# EAGLE schematic Wireless (EAGLE 7.3.0)
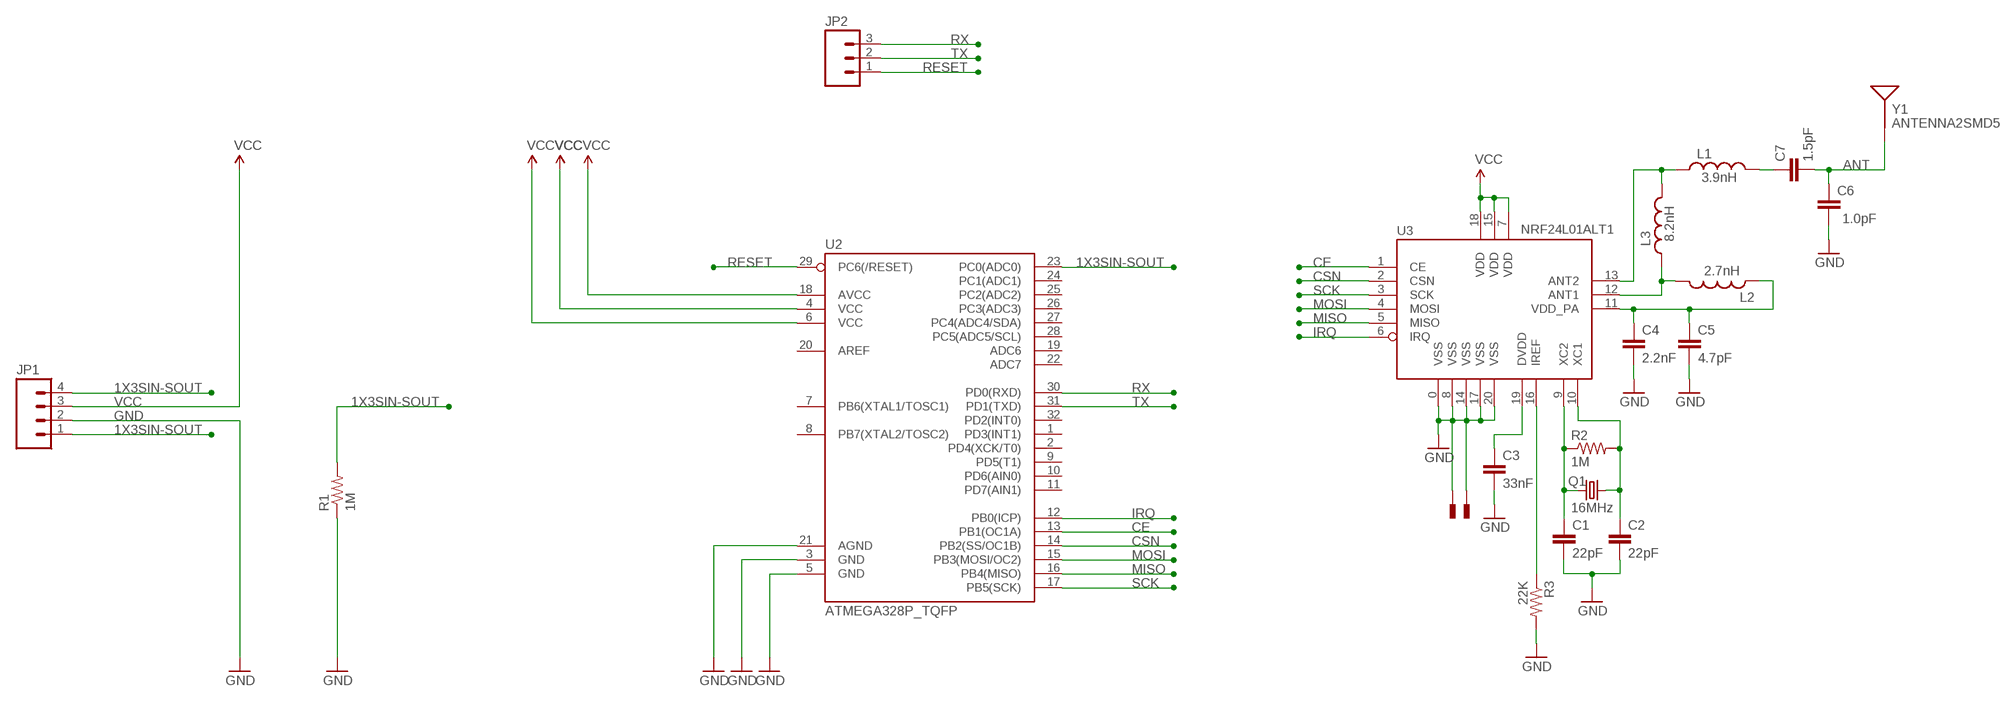
[diagram p0: schematic, sheet 1]

## Parts
C1  22pF  CAP0402-CAP  [0402-CAP]
C2  22pF  CAP0402-CAP  [0402-CAP]
C3  33nF  CAP0402-CAP  [0402-CAP]
C4  2.2nF  CAP0402-CAP  [0402-CAP]
C5  4.7pF  CAP0402-CAP  [0402-CAP]
C6  1.0pF  CAP0402-CAP  [0402-CAP]
C7  1.5pF  CAP0402-CAP  [0402-CAP]
JP1  M04PTH  [1X04]
JP2  M03PTH  [1X03]
L1  3.9nH  INDUCTOR0402  [C0402]
L2  2.7nH  INDUCTOR0402  [C0402]
L3  8.2nH  INDUCTOR0402  [C0402]
Q1  16MHz  CRYSTAL5X3  [CRYSTAL-SMD-5X3]
R1  1M  R-US_R0603  [R0603]
R2  1M  RESISTOR0402-RES  [0402-RES]
R3  22K  RESISTOR0402-RES  [0402-RES]
U2  ATMEGA328P_TQFP  [TQFP32-08]
U3  NRF24L01ALT1  [QFN20_ALT1]
U$1  PAD  [PAD-0.008]
U$4  PAD  [PAD-0.008]
Y1  ANTENNA2SMD5  [ANTENNA-CHIP5]

## Nets
1X3SIN-SOUT: JP1.1 JP1.4 R1.2 U2.23(PC0(ADC0))
ANT: C6.2 C7.2 Y1.FEED(SIGNAL)
CE: U2.13(PB1(OC1A)) U3.1(CE)
CSN: U2.14(PB2(SS/OC1B)) U3.2(CSN)
GND: C1.2 C2.2 C3.2 C4.2 C5.2 C6.1 JP1.2 R1.1 R3.2 U2.3(GND) U2.5(GND) U2.21(AGND) U3.0(VSS) U3.8(VSS) U3.14(VSS) U3.17(VSS) U3.20(VSS) U$1.P$1 U$4.P$1
IRQ: U2.12(PB0(ICP)) U3.6(IRQ)
MISO: U2.16(PB4(MISO)) U3.5(MISO)
MOSI: U2.15(PB3(MOSI/OC2)) U3.4(MOSI)
N$1: C1.1 Q1.1 R2.1 U3.9(XC2)
N$2: C2.1 Q1.3 R2.2 U3.10(XC1)
N$3: L2.2 L3.1 U3.12(ANT1)
N$4: R3.1 U3.16(IREF)
N$5: C3.1 U3.19(DVDD)
N$6: L1.1 L3.2 U3.13(ANT2)
N$7: C4.1 C5.1 L2.1 U3.11(VDD_PA)
N$9: C7.1 L1.2
RESET: JP2.1 U2.29(PC6(/RESET))
RX: JP2.3 U2.30(PD0(RXD))
SCK: U2.17(PB5(SCK)) U3.3(SCK)
TX: JP2.2 U2.31(PD1(TXD))
VCC: JP1.3 U2.4(VCC) U2.6(VCC) U2.18(AVCC) U3.7(VDD) U3.15(VDD) U3.18(VDD)
Unconnected: U2.1(PD3(INT1)) U2.2(PD4(XCK/T0)) U2.7(PB6(XTAL1/TOSC1)) U2.8(PB7(XTAL2/TOSC2)) U2.9(PD5(T1)) U2.10(PD6(AIN0)) U2.11(PD7(AIN1)) U2.19(ADC6) U2.20(AREF) U2.22(ADC7) U2.24(PC1(ADC1)) U2.25(PC2(ADC2)) U2.26(PC3(ADC3)) U2.27(PC4(ADC4/SDA)) U2.28(PC5(ADC5/SCL)) U2.32(PD2(INT0))

## Library data of the parts
C1-C7 = SparkFun:CAP: Capacitor Standard 0603 ceramic capacitor, and 0.1" leaded capacitor.
JP1 = SparkFun-Connectors:M04: Header 4 Standard 4-pin 0.1" header. Use with straight break away headers (SKU : PRT-00116), right angle break away headers (PRT-00553), swiss pins (PRT-00743), machine pins (PRT-00117), and female headers (PRT-00115). Molex polarized connector foot print use with SKU : PRT-08231 with associated crimp pins and housings. 1MM SMD Version SKU: PRT-10208
JP2 = SparkFun-Connectors:M03: Header 3 Standard 3-pin 0.1" header. Use with straight break away headers (SKU : PRT-00116), right angle break away headers (PRT-00553), swiss pins (PRT-00743), machine pins (PRT-00117), and female headers (PRT-00115). Molex polarized connector foot print use with SKU : PRT-08232 with associated crimp pins and housings.
L1-L3 = SparkFun:INDUCTOR: Inductors Basic Inductor/Choke - 0603 and 1206. Footprints are not proven and vary greatly between part numbers.
Q1 = SparkFun:CRYSTAL: Crystals Various standard crystals. Proven footprints. Spark Fun Electronics SKU : COM-00534
R1 = adafruit:R-US_: RESISTOR, American symbol
R2 R3 = SparkFun:RESISTOR: Resistor Basic schematic elements and footprints for 0603, 1206, and PTH resistors.
U2 = SparkFun-DigitalIC:ATMEGA328P_TQFP; PROD_ID: IC-09069
U3 = Testing:NRF24L01: 2.4GHz Low Power Transceiver This is the very popular, low cost, very low power RF transceiver from Nordic Semiconductor. Simple SPI interface. SKU: COM-00690
U$1 U$4 = Testing:PAD
Y1 = SparkFun:ANTENNA2: Antenna Single endded antenna. Common with smaller chip antennas. CHIP4 package is the GPS Chip Antenna SKU: GPS-08418. CHIP5 package is 2.4GHz chip antenna SKU: WRL-00144.